# Altium schematic sheet UPS.SchDoc: UPS
size A4; SheetNumber: 8
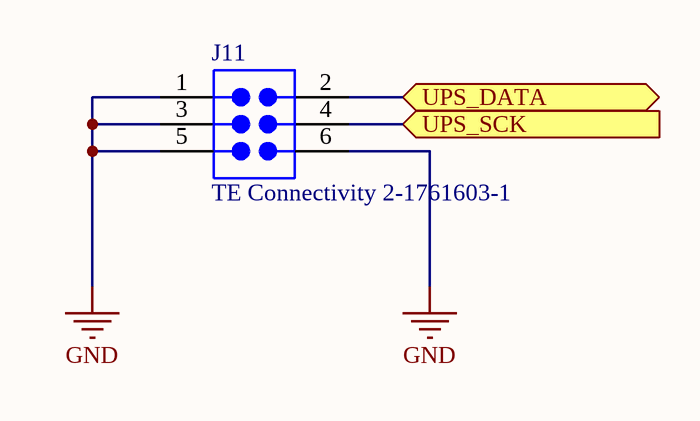
[diagram p0: UPS.SchDoc]

## Parts
J11  TE Connectivity 2-1761603-1  [PCB-alggvk0m4hnepl8fg6xg-1]

## Ports
UPS_DATA (bidir), UPS_SCK (in)

## Nets
GND: J11.1 J11.3 J11.5 J11.6
UPS_DATA: J11.2 ; port UPS_DATA
UPS_SCK: J11.4 ; port UPS_SCK

## Notes on the sheet
- Title
- Size:
- Date:
- A3
- Author:
- Time:
- Revision:
- Sheet
- of
- File:

## Library data of the parts
J11 = CMP-78cdb343a32fa70a-2: Wire-To-Board Connector, AMP-LATCH Series, Through Hole, Header, 6, 2.54 mm, Gold Plated Contacts; Lead-Free Status: Lead Free; Gender: Male; Pin Pitch: 2.54 mm; Number of Contacts: 6; OctopartID: 78cdb343a32fa70a; Lifecycle Status: Active; RoHS: Compliant; Octopart URL: http://octopart.com/2-1761603-1-te+connectivity-42270340; REACH SVHC Compliance: No SVHC; Color: Blue; Housing Color: Blue; Packaging: Bag; Housing Material: Thermoplastic